# Altium schematic sheet [02] - PWR 1V8.SchDoc
size A4; DocumentNumber: 2; SheetNumber: 2; SheetTotal: 15
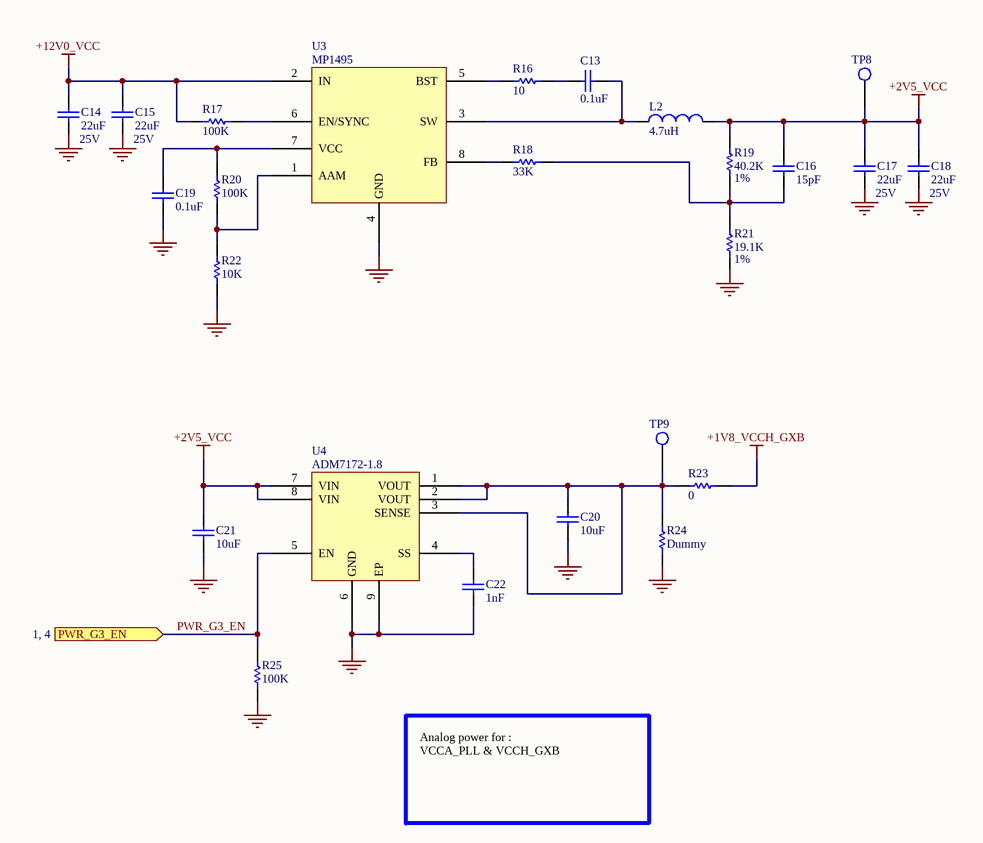
[diagram p0: [02] - PWR 1V8.SchDoc]

## Parts
C13  0.1uF  [0402_C]
C14  22uF  RATED_VOLTAGE: 25V  [1210_C]
C15  22uF  RATED_VOLTAGE: 25V  [1210_C]
C16  15pF  [0402_C]
C17  22uF  RATED_VOLTAGE: 25V  [1210_C]
C18  22uF  RATED_VOLTAGE: 25V  [1210_C]
C19  0.1uF  [0402_C]
C20  10uF  [0805_C]
C21  10uF  [0805_C]
C22  1nF  [0402_C]
L2  4.7uH  [IHLP-2525]
R16  10  [0402_R]
R17  100K  [0402_R]
R18  33K  [0402_R]
R19  40.2K  Tolerance: 1%  [0402_R]
R20  100K  [0402_R]
R21  19.1K  Tolerance: 1%  [0402_R]
R22  10K  [0402_R]
R23  0  [1210_R]
R24  Dummy  [1210_R]
R25  100K  [0402_R]
TP8  Test Point  [PIN_1.5mm]  (value not drawn)
TP9  Test Point  [PIN_1.5mm]  (value not drawn)
U3  MP1495  [TSOT23-8]
U4  ADM7172-1.8

## Ports
PWR_G3_EN (in, see 1, 4)

## Nets
+1V8_VCCH_GXB: R23.2
+2V5_VCC: C16.2 C17.2 C18.2 C21.2 L2.2 R19.2 TP8.1 U4.7(VIN) U4.8(VIN)
+12V0_VCC: C14.2 C15.2 R17.2 U3.2(IN)
GND: C14.1 C15.1 C17.1 C18.1 C19.1 C20.1 C21.1 C22.1 R21.1 R22.1 R24.1 R25.2 U3.4(GND) U4.6(GND) U4.9(EP)
PWR_G3_EN: R25.1 U4.5(EN) ; port PWR_G3_EN
NetC13_1: C13.1 R16.2
NetC13_2: C13.2 L2.1 U3.3(SW)
NetC16_1: C16.1 R18.2 R19.1 R21.2
NetC19_2: C19.2 R20.2 U3.7(VCC)
NetC20_2: C20.2 R23.1 R24.2 TP9.1 U4.1(VOUT) U4.2(VOUT) U4.3(SENSE)
NetC22_2: C22.2 U4.4(SS)
NetR16_1: R16.1 U3.5(BST)
NetR17_1: R17.1 U3.6(EN/SYNC)
NetR18_1: R18.1 U3.8(FB)
NetR20_1: R20.1 R22.2 U3.1(AAM)

## Notes on the sheet
- Analog power for :
  VCCA_PLL & VCCH_GXB

## Library data of the parts
C13 C19 = Cap SMD: Non-Pol SMD Capacitor; RATED_VOLTAGE: 25V; Value: 0.1uF; Manufacturer Part Num: *; Dielectric: *
C14 C15 C17 C18 = Cap SMD: Non-Pol SMD Capacitor; Manufacturer Part Num: GRM32ER71E226KE15; Dielectric: X7R; Value: 22uF
C16 C22 = Cap SMD: Non-Pol SMD Capacitor; RATED_VOLTAGE: 16V; Manufacturer Part Num: *; Dielectric: *
  C16: Value: 15pF
  C22: Value: 1nF
C20 C21 = Cap SMD: Non-Pol SMD Capacitor; Manufacturer Part Num: GRM21BR71A106MA73; RATED_VOLTAGE: 10V; Dielectric: X7R; Value: 10uF
L2 = Inductor: Inductor SMD; Manufacturer Part Num: IHLP2525CZER4R7M01; Value: 4.7uH
R16-R18 R20 R22-R25 = Res SMD: SMD Resistor; Tolerance: 5%; Manufacturer Part Num: *
  R16: Value: 10
  R17 R20 R25: Value: 100K
  R18: Value: 33K
  R22: Value: 10K
  R23: Value: 0
  R24: Value: Dummy
R19 R21 = Res SMD: SMD Resistor; Manufacturer Part Num: *
  R19: Value: 40.2K
  R21: Value: 19.1K
TP8 TP9 = Test Point: Test Point Footprint; Value: Test Point
U3 = MP1495: High Efficiency 3A, 16V, 500kHz Synchronous Step Down Converter; Manufacturer Part Num: MP1495SGJ-Z; Value: MP1495
U4 = ADM7172: 6.5 V, 2 A, Ultralow Noise, High PSRR, Fast Transient Response CMOS LDO; Manufacturer Part Num: ADM7172ACPZ-1.8-R7; Value: ADM7172-1.8